# EasyEDA Pro project MicroMouse_v04.eprj, board PCB2
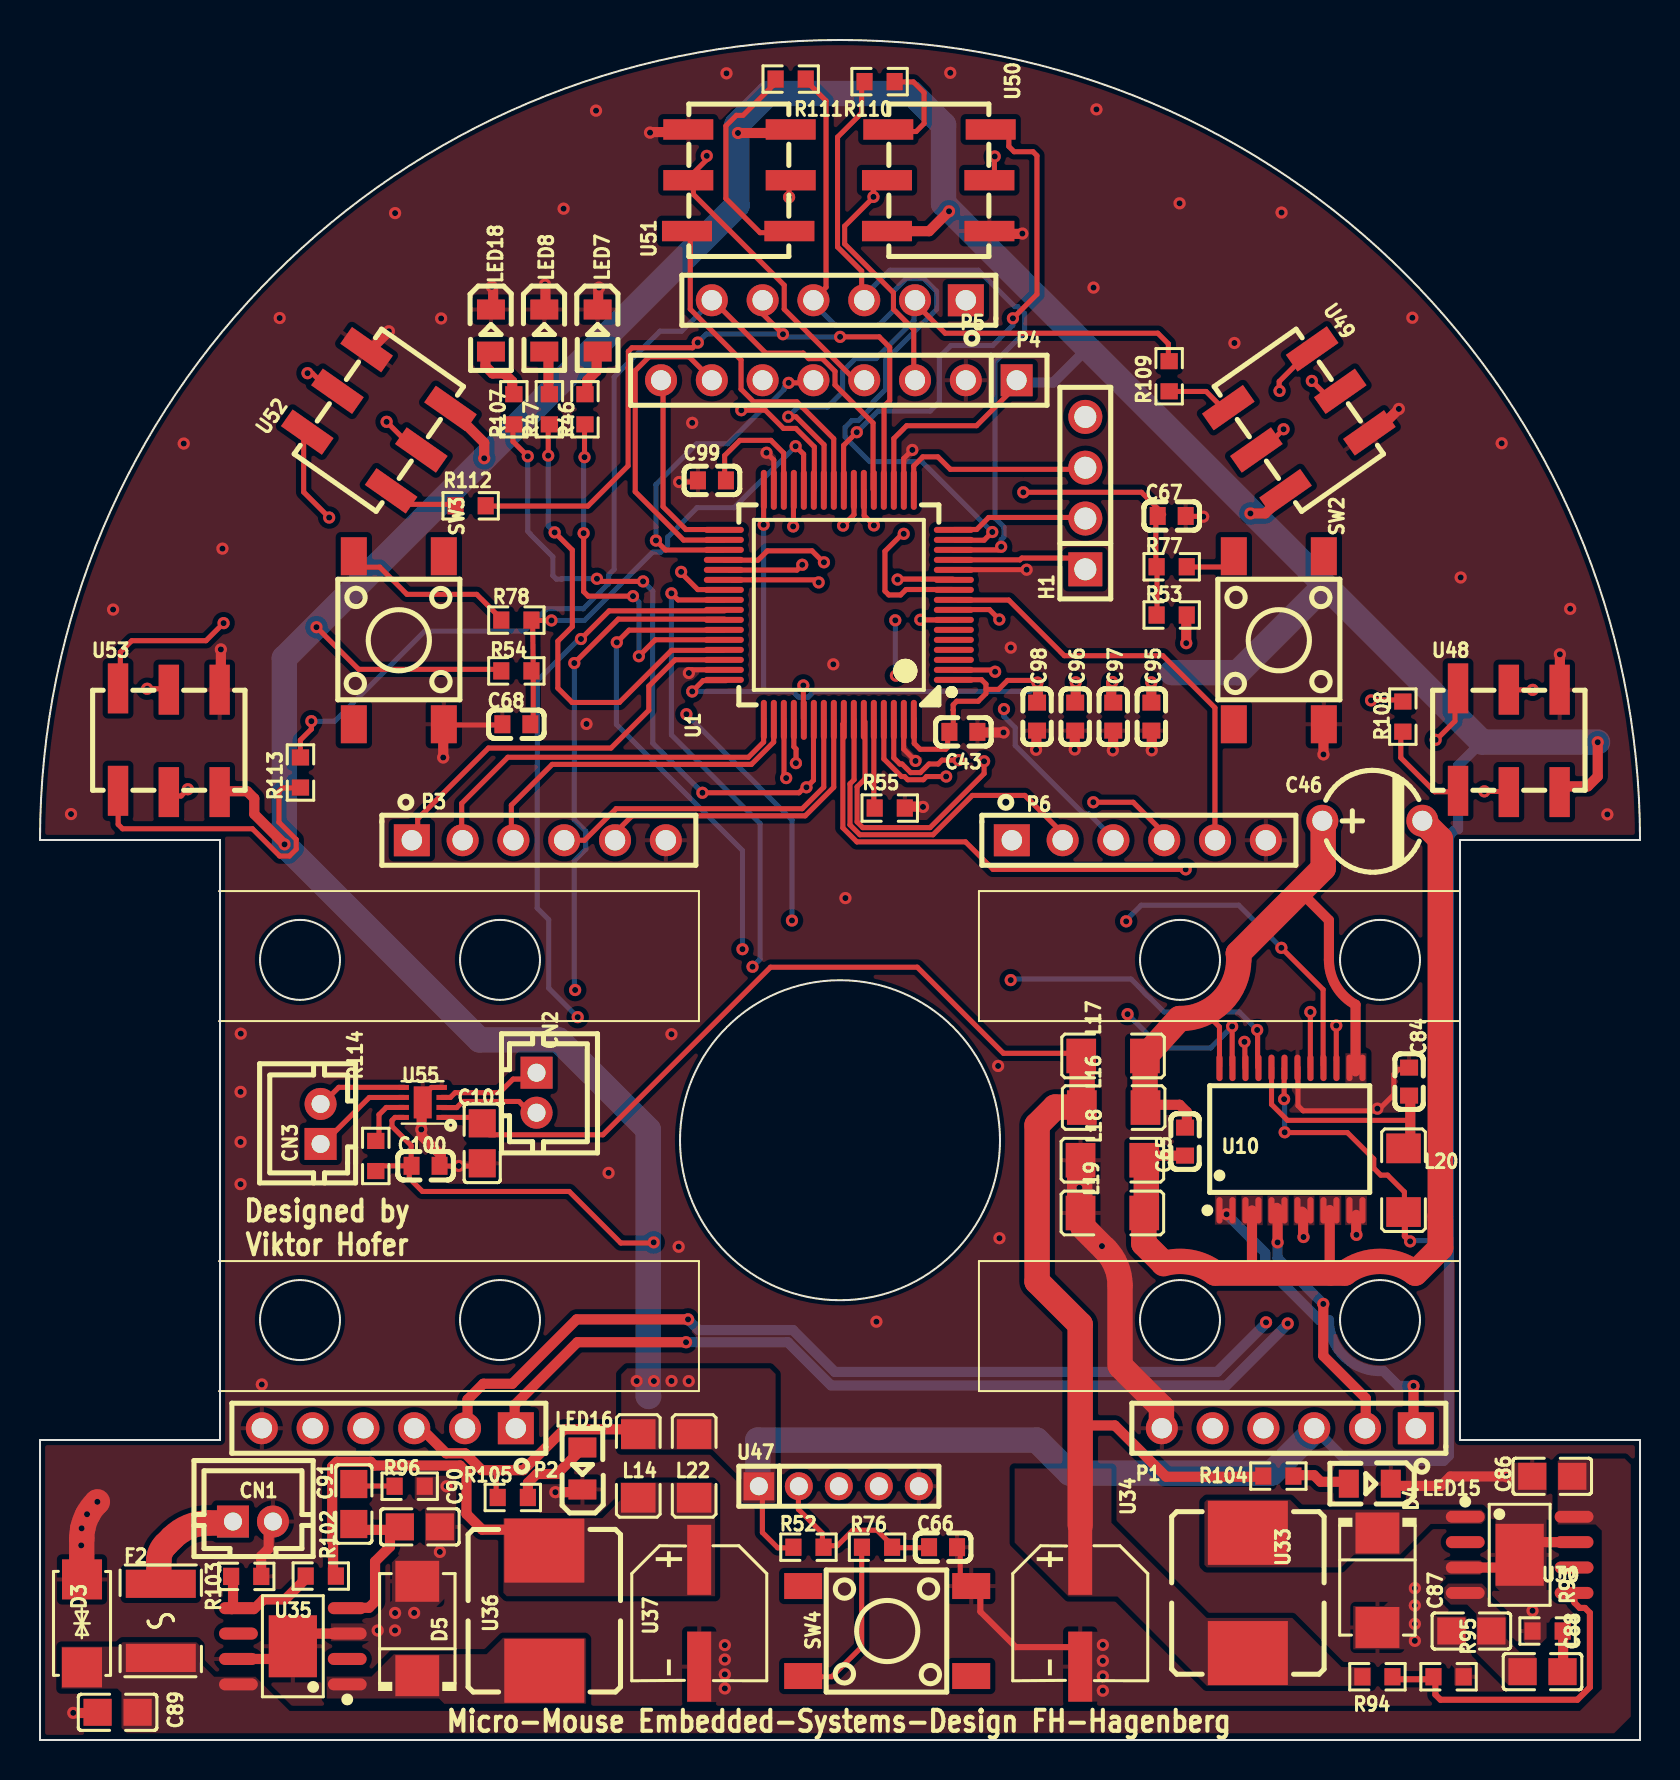
[diagram p6: board, top side]
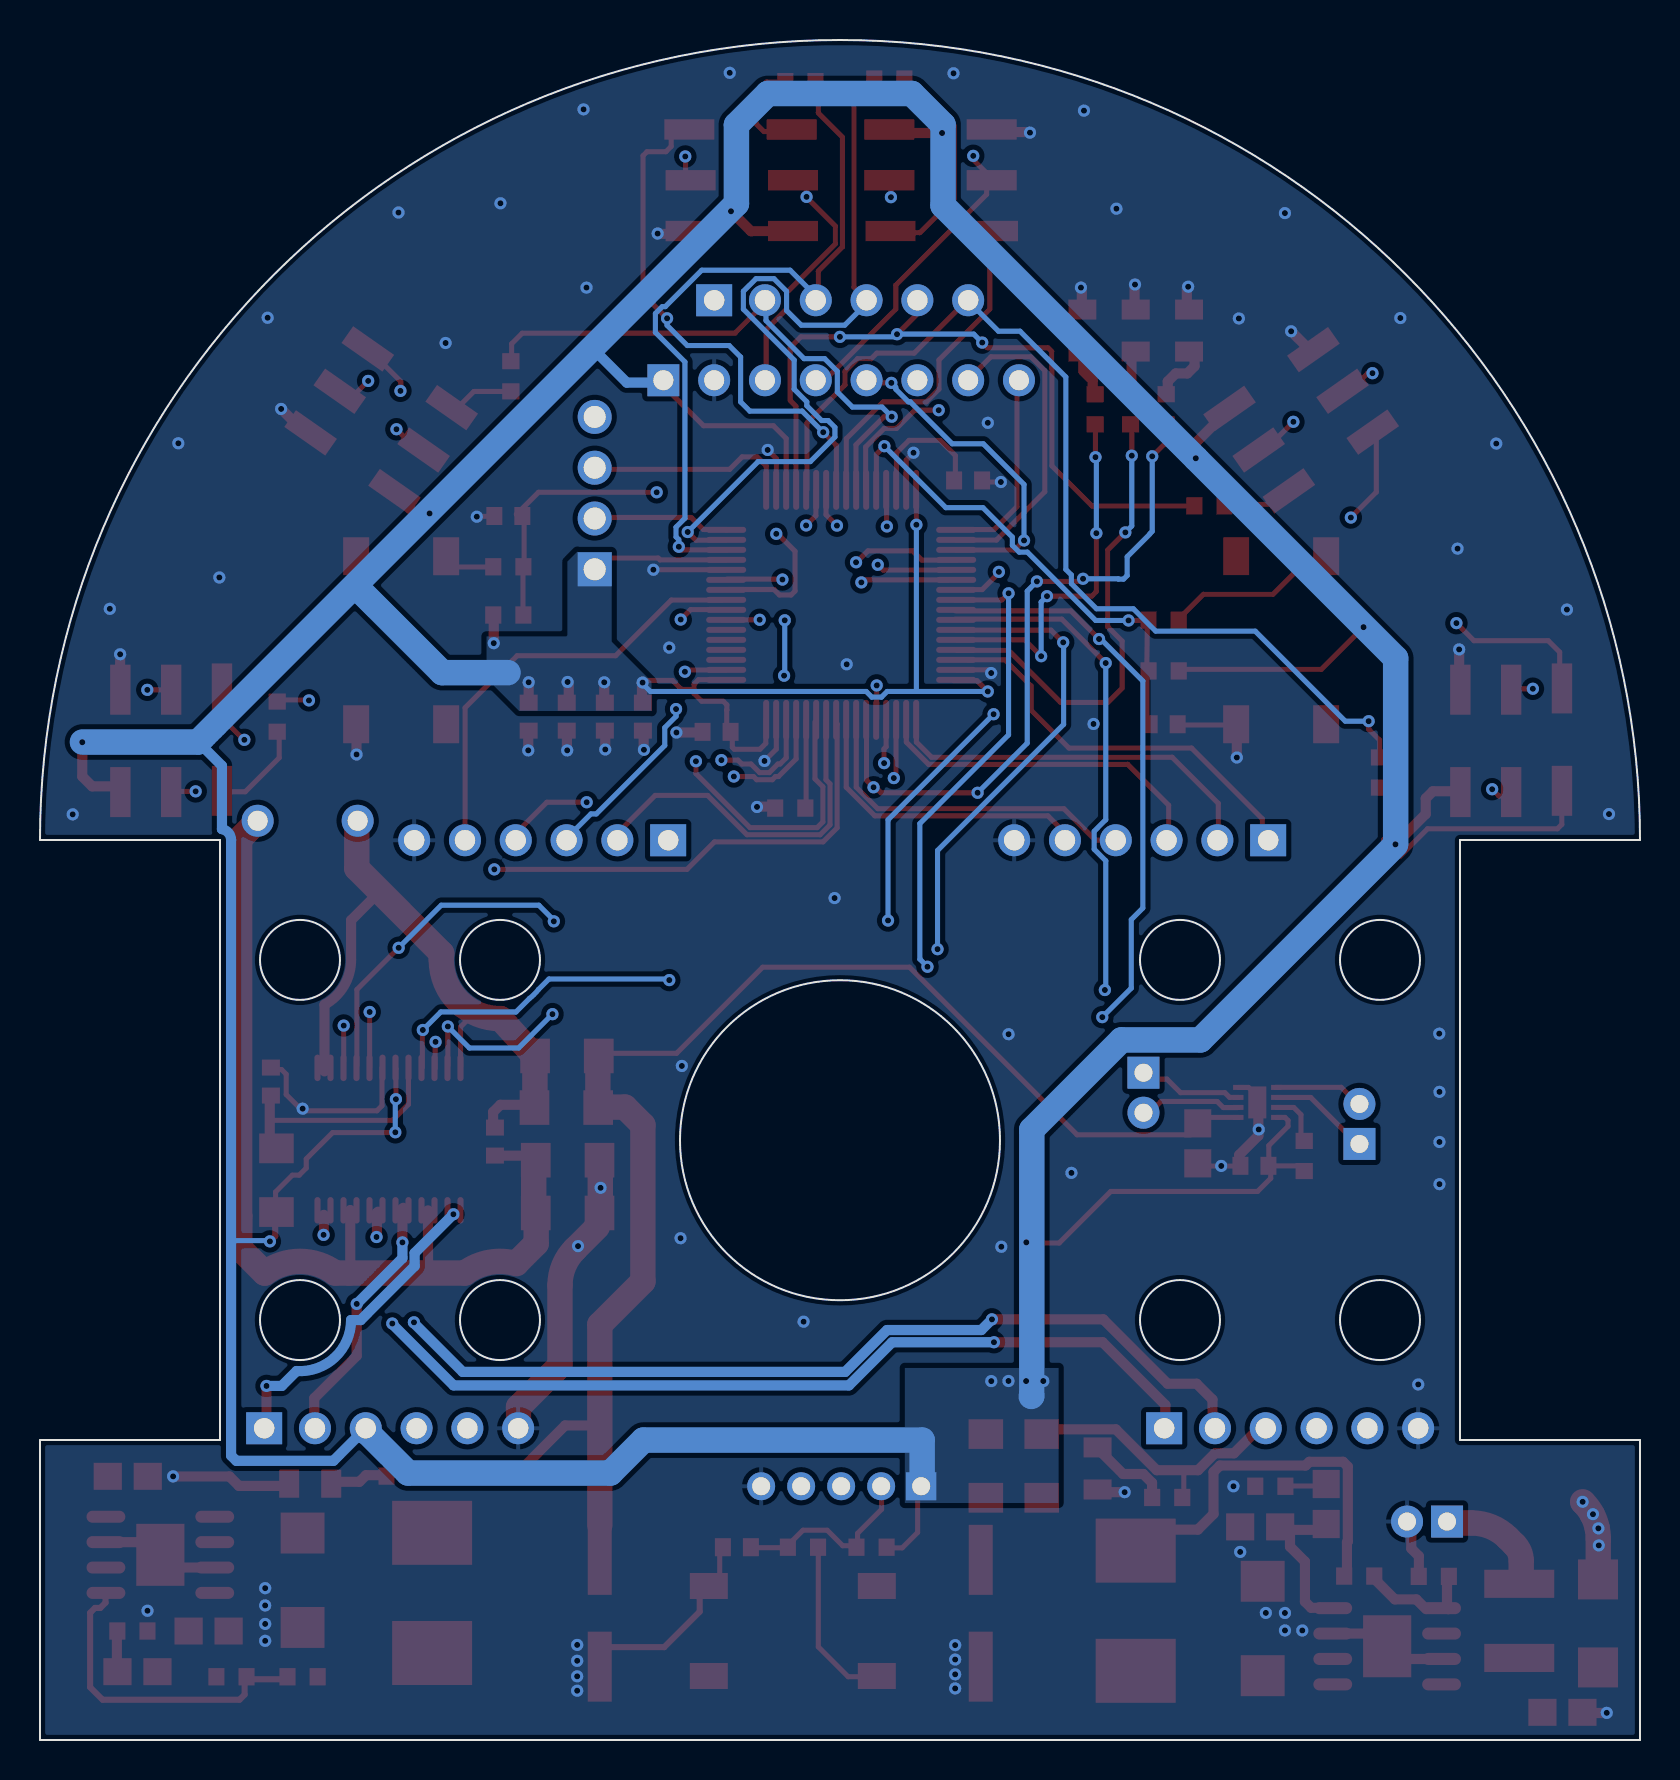
[diagram p7: board, bottom side, seen from below]

Outline 80 x 85 mm; copper layers: Top Layer, Inner1, Inner2, Inner3, Inner4, Bottom Layer. Coordinates in mm from the lower left corner of the outline.
Outline path: circle c13,39.01 r2 ; circle c13,21 r2 ; circle c23,39.01 r2 ; circle c23,21 r2 ; circle c40,29.99 r8 ; circle c57,39.01 r2 ; circle c57,21 r2 ; circle c67,39.01 r2 ; circle c67,21 r2 ; 0,45 9,45 9,15 0,15 0,0 80,0 80,15 71,15 71,45 80,45 arc(40,85) 0,45
Stack: Top Layer 0.035mm Outer layer thickness 1oz / Dielectric1 0.0994mm 3313 RC57% 4.2mil / Inner1 0.0152mm Inner layer thickness / Dielectric2 0.55mm 0.55mm H/H No copper / Inner2 0.0152mm Inner layer thickness / Dielectric3 0.1088mm 2116 RC54% 4.9mil / Inner3 0.0152mm Inner layer thickness / Dielectric4 0.55mm 0.55mm H/H No copper / Inner4 0.0152mm Inner layer thickness / Dielectric5 0.0994mm 3313 RC57% 4.2mil / Bottom Layer 0.035mm Outer layer thickness 1oz

## Design rules (mm)
template: JLCPCB Capability(Multiple Layers Board)
spacing copperThickness1oz (default): track to track 0.102, other pairs 0.152 to 0.3
spacing copperThickness2oz: track to track 0.203, other pairs 0.152 to 0.3
spacing copperThicknessInner0.5oz: track to track 0.089, other pairs 0.152 to 0.3
track width copperThickness1oz (default): min 0.102, default 0.254, max 2.54
track width copperThickness2oz: min 0.203, default 0.254, max 2.54
track width copperThickness0.5oz: min 0.089, default 0.254, max 2.54
differential pair differentialPair (default): width min 0.127, default 0.254, max 2.54; gap min 0.152, default 0.152
via viaSize (default): diameter min 0.3, default 0.61, max 10; hole min 0.2, default 0.305, max 6.3

## Placement (name value [footprint] x y rotation side)
C43  1uF  [C0603]  46.17 50.41 0 top
C46  10uF  [CAP-TH_BD5.0-P5.00-D1.0-FD]  66.62 45.96 0 top
C65  100nF  [C0603]  57.25 29.92 90 top
C66  100nF  [C0603]  45.15 9.64 180 top
C67  100nF  [C0603]  56.58 61.2 180 top
C68  100nF  [C0603]  23.82 50.79 0 top
C84  100nF  [C0603]  68.45 32.92 270 top
C86  10uF  [C0805]  75.61 13.18 0 top
C87  220pF  [C0805]  71.57 5.45 0 top
C88  22nF  [C0805]  75.13 3.42 180 top
C89  10uF  [C0805]  3.88 1.38 0 top
C90  220pF  [C0805]  18.99 10.66 180 top
C91  22nF  [C0805]  15.69 11.8 270 top
C95  100nF  [C0603]  55.57 51.17 90 top
C96  100nF  [C0603]  51.76 51.17 90 top
C97  100nF  [C0603]  53.66 51.17 90 top
C98  100nF  [C0603]  49.85 51.17 90 top
C99  4.7uF  [C0603]  33.6 62.98 0 top
C100  100nF  [C0603]  19.28 28.71 180 top
C101  10uF  [C0805]  22.11 29.83 90 top
CN1  HX-PH2.0-2PZZ  [CONN-TH_2P-P2.50_HX-PH2.0-2PZZ]  10.65 10.92 0 top
CN2  HX-PH2.0-2PZZ  [CONN-TH_2P-P2.50_HX-PH2.0-2PZZ]  24.83 32.36 270 top
CN3  HX-PH2.0-2PZZ  [CONN-TH_2P-P2.50_HX-PH2.0-2PZZ]  14.03 30.8 90 top
D3  SMAJ20CA  [SMA_L4.3-W2.6-LS5.2-BI]  2.1 5.83 270 top
D4  STPS2L25U  [SMB_L4.6-W3.6-LS5.3-RD]  66.87 7.99 270 top
D5  STPS2L25U  [SMB_L4.6-W3.6-LS5.3-RD]  18.86 5.58 90 top
F2  ASMD1812-300  [F1812]  6.04 5.96 90 top
H1  2.54-1*4P  [HDR-TH_4P-P2.54-V-F]  52.27 62.34 90 top
L14  LI1206H151R-10  [L1206]  29.91 13.7 90 top
L16  LI1206H151R-10  [L1206]  53.68 31.62 0 top
L17  LI1206H151R-10  [L1206]  53.65 34.2 0 top
L18  LI1206H151R-10  [L1206]  53.62 28.99 0 top
L19  LI1206H151R-10  [L1206]  53.62 26.35 0 top
L20  LI1206H151R-10  [L1206]  68.18 27.99 270 top
L22  LI1206H151R-10  [L1206]  32.71 13.7 90 top
LED7  XL-2012SURC  [LED0805-R-RD]  27.88 70.47 270 top
LED8  XL-2012SURC  [LED0805-R-RD]  25.21 70.47 270 top
LED15  XL-2012SURC  [LED0805-R-RD]  66.49 12.81 180 top
LED16  XL-2012SURC  [LED0805-R-RD]  27.12 13.58 90 top
LED18  XL-2012SURC  [LED0805-R-RD]  22.55 70.47 270 top
P1  2.54-1*6P  [HDR-TH_6P-P2.54-V-F]  62.44 15.59 180 top
P2  2.54-1*6P  [HDR-TH_6P-P2.54-V-F]  17.44 15.59 180 top
P3  2.54-1*6P  [HDR-TH_6P-P2.54-V-F]  24.94 44.99 0 top
P4  2.54-1*8P母环保  [HDR-TH_8P-P2.54-V-F_2]  39.94 67.99 180 top
P5  2.54-1*6P  [HDR-TH_6P-P2.54-V-F]  39.94 71.99 180 top
P6  2.54-1*6P  [HDR-TH_6P-P2.54-V-F]  54.94 44.99 0 top
R46  10K  [R0603]  27.25 66.54 270 top
R47  10K  [R0603]  25.47 66.54 270 top
R52  10K  [R0603]  38.42 9.64 180 top
R53  10K  [R0603]  56.58 56.25 0 top
R54  10K  [R0603]  23.82 53.45 180 top
R55  10K  [R0603]  42.49 46.6 0 top
R76  1kΩ  [R0603]  41.85 9.64 180 top
R77  1kΩ  [R0603]  56.58 58.66 0 top
R78  1kΩ  [R0603]  23.82 55.99 180 top
R93  4.7kΩ  [R0603]  75.38 5.45 0 top
R94  24kΩ  [R0603]  66.87 3.16 180 top
R95  6.2kΩ  [R0603]  70.43 3.16 180 top
R96  4.7kΩ  [R0603]  18.48 12.69 180 top
R102  3kΩ  [R0603]  14.04 8.2 0 top
R103  1.8kΩ  [R0603]  10.31 8.18 180 top
R104  10K  [R0603]  61.92 13.2 180 top
R105  10K  [R0603]  23.64 12.13 180 top
R107  10K  [R0603]  23.69 66.54 270 top
R108  0Ω  [R0603]  68.14 51.17 90 top
R109  0Ω  [R0603]  56.46 68.19 90 top
R110  0Ω  [R0603]  41.98 82.92 180 top
R111  0Ω  [R0603]  37.53 83.05 0 top
R112  0Ω  [R0603]  21.53 61.71 0 top
R113  0Ω  [R0603]  13.02 48.37 90 top
R114  10K  [R0603]  16.79 29.2 270 top
SW2  TS-1002S-04326C  [KEY-SMD_4P-L6.0-W6.0-P4.50-LS9.0]  61.94 54.99 270 top
SW3  TS-1002S-04326C  [KEY-SMD_4P-L6.0-W6.0-P4.50-LS9.0]  17.94 54.99 270 top
SW4  TS-1002S-04326C  [KEY-SMD_4P-L6.0-W6.0-P4.50-LS9.0]  42.36 5.45 0 top
U1  STM32F446RET6  [LQFP-64_L10.0-W10.0-P0.50-LS12.0-BL]  39.94 56.76 90 top
U10  TB6612FNG,C,8,EL  [SSOP-24_L8.3-W5.6-P0.65-LS7.6-BL]  62.55 30.05 0 top
U30  L5973D  [SOIC-8_L4.9-W3.9-P1.27-LS6.0-BL-EP]  73.98 9.26 270 top
U33  1.5uH  [IND-SMD_L7.6-W6.9]  60.39 7.35 270 top
U34  330uF  [CAP-SMD_BD6.3-L6.6-W6.6-LS7.4-FD]  52.01 6.34 270 top
U35  L5973D  [SOIC-8_L4.9-W3.9-P1.27-LS6.0-BL-EP]  12.64 4.69 90 top
U36  1.5uH  [IND-SMD_L7.6-W6.9]  25.21 6.46 90 top
U37  330uF  [CAP-SMD_BD6.3-L6.6-W6.6-LS7.4-FD]  32.96 6.34 270 top
U47  DW200R-11-05-43  [HDR-TH_5P-P2.00-V-F]  39.94 12.69 0 top
U48  HC-PM254-5.0H-2x3PS-02A  [CONN-SMD_HC-PM254-5.0H-2X3PS-02A]  73.44 49.99 0 top
U49  HC-PM254-5.0H-2x3PS-02A  [CONN-SMD_HC-PM254-5.0H-2X3PS-02A]  62.94 65.99 305 top
U50  HC-PM254-5.0H-2x3PS-02A  [CONN-SMD_HC-PM254-5.0H-2X3PS-02A]  44.94 77.99 270 top
U51  HC-PM254-5.0H-2x3PS-02A  [CONN-SMD_HC-PM254-5.0H-2X3PS-02A]  34.94 77.99 90 top
U52  HC-PM254-5.0H-2x3PS-02A  [CONN-SMD_HC-PM254-5.0H-2X3PS-02A]  16.94 65.99 55 top
U53  HC-PM254-5.0H-2x3PS-02A  [CONN-SMD_HC-PM254-5.0H-2X3PS-02A]  6.44 49.99 0 top
U55  DRV8838DSGR  [WSON-8_L2.0-W2.0-P0.50-TL-EP]  19.14 31.88 180 top

## Footprints (pads in the part's own frame, mm; a bottom-side part is the same pattern mirrored in y, then rotated)
C0603
  rect 0.8x0.9 smd: 1(-0.7,0) 2(0.7,0)
C0805
  rect 1.41x1.35 smd: 1(-1,0) 2(1,0)
CAP-SMD_BD6.3-L6.6-W6.6-LS7.4-FD
  rect 3.5x1.2 smd: 1(-2.67,0) 2(2.67,0)
CAP-TH_BD5.0-P5.00-D1.0-FD
  round 1.6 hole 1: 1(-2.5,0) 2(2.5,0)
CONN-SMD_HC-PM254-5.0H-2X3PS-02A
  rect 1.02x2.5 smd: 1(-2.54,2.592) 2(-2.54,-2.527) 3(0,2.527) 4(0,-2.592) 5(2.54,2.527) 6(2.54,-2.592)
CONN-TH_2P-P2.50_HX-PH2.0-2PZZ
  rect 1.6x1.6 hole 0.9: 1(-1,0)
  round 1.6 hole 0.9: 2(1,0)
F1812
  rect 1.407x3.499 smd: 1(-1.853,0) 2(1.853,0)
HDR-TH_4P-P2.54-V-F
  rect 1.7x1.7 hole 1.1: 1(-3.81,0)
  round 1.7 hole 1.1: 2(-1.27,0) 3(1.27,0) 4(3.81,0)
HDR-TH_5P-P2.00-V-F
  rect 1.524x1.4 hole 0.9: 1(-4,0)
  round 1.4 hole 0.9: 2(-2,0) 3(0,0) 4(2,0) 5(4,0)
HDR-TH_6P-P2.54-V-F
  rect 1.8x1.6 hole 1.02: 1(-6.35,0)
  round 1.6 hole 1.02: 2(-3.81,0) 3(-1.27,0) 4(1.27,0) 5(3.81,0) 6(6.35,0)
HDR-TH_8P-P2.54-V-F_2
  rect 1.6x1.6 hole 1: 1(-8.89,0)
  round 1.6 hole 1: 2(-6.35,0) 3(-3.81,0) 4(-1.27,0) 5(1.27,0) 6(3.81,0) 7(6.35,0) 8(8.89,0)
IND-SMD_L7.6-W6.9
  rect 3.2x4 smd: 1(-3.005,0) 2(3.005,0)
KEY-SMD_4P-L6.0-W6.0-P4.50-LS9.0
  rect 1.9x1.3 smd: 1(-4.2,2.25) 2(4.2,2.25) 3(-4.2,-2.25) 4(4.2,-2.25)
L1206
  rect 1.485x1.728 smd: 1(-1.593,0) 2(1.593,0)
LED0805-R-RD
  rect 1x1.399 smd: 1(1.05,0) 2(-1.05,0)
LQFP-64_L10.0-W10.0-P0.50-LS12.0-BL
  oval 0.3x2 smd: 1(-3.75,-5.75) 2(-3.25,-5.75) 3(-2.75,-5.75) 4(-2.25,-5.75) 5(-1.75,-5.75) 6(-1.25,-5.75) 7(-0.75,-5.75) 8(-0.25,-5.75) 9(0.25,-5.75) 10(0.75,-5.75) 11(1.25,-5.75) 12(1.75,-5.75) 13(2.25,-5.75) 14(2.75,-5.75) 15(3.25,-5.75) 16(3.75,-5.75) 33(3.75,5.75) 34(3.25,5.75) 35(2.75,5.75) 36(2.25,5.75) 37(1.75,5.75) 38(1.25,5.75) 39(0.75,5.75) 40(0.25,5.75) 41(-0.25,5.75) 42(-0.75,5.75) 43(-1.25,5.75) 44(-1.75,5.75) 45(-2.25,5.75) 46(-2.75,5.75) 47(-3.25,5.75) 48(-3.75,5.75)
  oval 2x0.3 smd: 17(5.75,-3.75) 18(5.75,-3.25) 19(5.75,-2.75) 20(5.75,-2.25) 21(5.75,-1.75) 22(5.75,-1.25) 23(5.75,-0.75) 24(5.75,-0.25) 25(5.75,0.25) 26(5.75,0.75) 27(5.75,1.25) 28(5.75,1.75) 29(5.75,2.25) 30(5.75,2.75) 31(5.75,3.25) 32(5.75,3.75) 49(-5.75,3.75) 50(-5.75,3.25) 51(-5.75,2.75) 52(-5.75,2.25) 53(-5.75,1.75) 54(-5.75,1.25) 55(-5.75,0.75) 56(-5.75,0.25) 57(-5.75,-0.25) 58(-5.75,-0.75) 59(-5.75,-1.25) 60(-5.75,-1.75) 61(-5.75,-2.25) 62(-5.75,-2.75) 63(-5.75,-3.25) 64(-5.75,-3.75)
R0603
  rect 0.806x0.864 smd: 1(-0.753,0) 2(0.753,0)
SMA_L4.3-W2.6-LS5.2-BI
  rect 2x2 smd: 1(-2.2,0) 2(2.2,0)
SMB_L4.6-W3.6-LS5.3-RD
  rect 2.047x2.192 smd: 1(-2.361,0) 2(2.361,0)
SOIC-8_L4.9-W3.9-P1.27-LS6.0-BL-EP
  oval 0.602x1.941 smd: 1(-1.905,-2.72) 2(-0.635,-2.72) 3(0.635,-2.72) 4(1.905,-2.72) 5(1.905,2.72) 6(0.635,2.72) 7(-0.635,2.72) 8(-1.905,2.72)
  rect 3.098x2.41 smd: 9(0,0)
SSOP-24_L8.3-W5.6-P0.65-LS7.6-BL
  oval 0.308x1.324 smd: 1(-3.575,-3.562) 2(-2.925,-3.562) 3(-2.275,-3.562) 4(-1.625,-3.562) 5(-0.975,-3.562) 6(-0.325,-3.562) 7(0.325,-3.562) 8(0.975,-3.562) 9(1.625,-3.562) 10(2.275,-3.562) 11(2.925,-3.562) 12(3.575,-3.562) 13(3.575,3.562) 14(2.925,3.562) 15(2.275,3.562) 16(1.625,3.562) 17(0.975,3.562) 18(0.325,3.562) 19(-0.325,3.562) 20(-0.975,3.562) 21(-1.625,3.562) 22(-2.275,3.562) 23(-2.925,3.562) 24(-3.575,3.562)
WSON-8_L2.0-W2.0-P0.50-TL-EP
  rect 0.521x0.25 smd: 1(-0.95,0.75) 2(-0.95,0.25) 3(-0.95,-0.25) 4(-0.95,-0.75) 5(0.95,-0.75) 6(0.95,-0.25) 7(0.95,0.25) 8(0.95,0.75)
  rect 0.9x1.6 smd: 9(0,0)

## Nets
As in the schematic.

Pads without a net: P4 6; SW2 1 4; SW3 1 4; SW4 1 4; U1 3 4 5 6; U30 2 6; U35 2 6

## Via types
v1: diameter 0.61, hole 0.305, Top Layer to Bottom Layer, 209 vias

## Routing (per net, layer and track width the routed paths; a pad name or vN(x,y) marks a point on that pad's centre or on a via; arc(x,y) is an arc through that point)
6V: length 72
  Top Layer w0.254: 21.88,31.08 21.84,31.13 U55.1 ; 22.48,30.26 28.14,30.26 36.53,38.64 43.86,38.64 48.17,34.34 51.75,34.34
  Top Layer w0.508: 52.33,15.71 52.34,15.73 53.74,15.73 56.31,13.16 60.98,13.16
  Top Layer w1.27: 52.01,10.75 52.01,20.77 49.85,22.93 49.85,30.75 50.75,31.65 52.11,31.65 52.11,34.1
+3V3: length 374.2
  Top Layer w0.254: 43.71,51.04 43.71,49.83 44,49.54 45.28,49.54 45.38,49.64 45.38,50.37 ; 22.81,11.87 22.81,13.34 22.71,13.44 ; v1(13.82,55.64) 15.93,53.53 23.08,53.53 ; 52.05,58.8 51.75,59.1 49.09,59.1 49,59.01 45.69,59.01 ; 45.59,53 45.6,53.02 47.08,53.02 47.3,52.79 47.3,52.33 46.91,51.94 45.84,51.94 45.66,51.76 45.66,51.51 45.66,51.5 45.66,50.7 ; v1(62.2,32.04) 62.2,33.56 62.22,33.58 ; 30.69,24.85 29.04,24.85 26.46,27.43 19.12,27.43 18.46,28.09 18.46,28.44 ; 18.18,31.13 17.75,31.13 17.6,30.98 17.6,30.68 18.56,29.72 18.56,28.9 18.57,28.89 ; v1(32.61,52.43) 33.15,52.97 34.31,52.97 ; 62.23,30.37 65.37,30.37 66.69,29.05 66.69,28.59 67.04,28.24 67.38,28.24 68.22,27.4 68.22,26.86 ; 49.74,52.98 48.38,52.98 47.93,52.53 47.31,52.53 47.3,52.54 ; 48.91,67.8 46.82,65.71 43.33,65.71 42.69,65.07 42.69,62.91 ; 36.18,62.5 v1(36.18,60.76) ; 37.5,9.61 36.89,9.61 36.12,10.38 36.12,12.57 ; 18.36,28.71 17.06,28.71 16.79,28.44
  Top Layer w0.305: v1(68.51,24.93) 68.24,25.2 68.24,26.29
  Top Layer w0.508: 8.97,47.52 9.05,47.44 10.35,47.44 10.71,47.08 10.71,46.3 v1(12.23,44.78) ; 20.54,66.53 22.21,64.86 v1(22.21,64.09) ; v1(53.62,52.9) 53.56,52.84 53.56,51.85 ; v1(77.89,49.89) 77.89,48.18 77.39,47.68 76.12,47.68 ; 42.55,75.44 44.45,75.44 v1(45.45,76.44) ; 55.55,51.91 55.57,51.92 v1(55.57,52.89) ; 57.31,56.17 v1(57.31,54.84) ; v1(51.79,52.89) 51.79,52.05 51.73,51.99 ; 19.28,15.36 20.3,14.33 21.25,14.33 22.1,13.49 24.16,13.49 26.21,15.53 29.47,15.53 29.59,15.4 ; v1(60.52,61.33) 61.26,61.33 62.31,62.38 ; v1(34.9,80.35) 37.29,80.35 37.51,80.57 ; 49.9,51.95 49.9,52.84
  Bottom Layer w0.254: 36.2,52.43 36.18,52.45 v1(36.18,60.76) ; v1(62.23,30.39) 62.23,32.01 v1(62.2,32.04) ; v1(32.61,52.43) 37.64,52.43 37.92,52.14 38.41,52.14 38.69,52.43 49.48,52.43 49.91,52.86 ; 68.53,24.97 70.33,24.97 70.36,25.01
  Bottom Layer w0.508: 72.05,49.86 70.9,48.71 70.9,45.55 arc(70.57,45.36) 70.45,45 70.45,14.22 70.18,13.96 65.33,13.96 63.53,15.76 ; 52.29,69.5 50.66,67.87 48.97,67.87
  Bottom Layer w1.27: 35.89,13.05 35.89,15 49.83,15 51.48,13.35 61.6,13.35 63.64,15.39 ; 77.88,49.9 72.09,49.9 45.18,76.82 45.18,80.76 43.61,82.33 36.41,82.33 34.85,80.77 34.85,76.72 22.21,64.09 12.22,54.09 12.22,44.82 ; 12.23,44.76 21.98,35.01 25.92,35.01 30.41,30.52 30.41,17.2 30.44,17.18 ; 56.6,53.37 59.89,53.37 64.18,57.65
  vias: v1(29.83,17.95) v1(30.68,24.88) v1(30.69,17.95) v1(31.58,17.95) v1(32.44,17.94) v1(49.87,52.87)
+6V_MOT: length 34.1
  Top Layer w0.254: 58.97,33.65 58.97,35.65 58.47,36.16
  Top Layer w0.508: 57.34,30.64 57.34,31.4 56.98,31.76 55.26,31.76 55.25,31.75 ; 65.78,33.43 65.78,36.76 arc(64.8,37.7) 64.45,39.01 64.45,40.99 63.08,42.35
  Top Layer w1.27: 55.25,34.17 55.25,34.24 ; 55.25,34.17 55.24,34.15 ; 55.25,34.17 55.25,31.62 ; 64.16,45.91 64.16,43.58 59.92,39.33 arc(59.93,39.17) 59.94,39.01 arc(59.07,36.92) 56.97,36.07 55.29,34.21
AGND: length 50.6
  Top Layer w0.508: 64.48,26.5 64.48,23.4 64.54,23.35 ; 60.6,26.48 60.6,23.49 60.65,23.44 ; 55.4,29.22 57.01,29.22 57.04,29.25
  Top Layer w1.27: 64.54,23.35 58.76,23.35 arc(57.52,23.88) 56.18,23.82 ; 70.02,26.2 70.03,24.61 68.76,23.34 ; 70.02,26.2 70.02,45.05 69.11,45.95 ; 70.02,26.2 70.02,24.91 ; 56.14,23.87 55.19,24.82 55.19,26.42 ; 64.54,23.35 65.25,23.35 arc(67,23.93) 68.76,23.35 ; 55.31,28.57 55.31,26.58
GND: length 101.7
  Top Layer w0.254: v1(31.96,62.9) 32.91,62.9 32.92,62.91 ; 34.15,53.51 32.6,53.51 v1(32.44,53.35) ; 46.25,7.82 46.01,8.06 46.01,9.71 ; 19.41,32.47 19.57,32.63 20.09,32.63 ; 36.69,62.51 36.69,64 v1(36.32,64.36) ; v1(43.78,48.95) 43.18,49.55 43.18,51.01 ; 20.6,50.75 22.97,50.75 23.1,50.62 ; 57.27,61.18 58.14,61.18 v1(58.16,61.17) ; 62.9,33.62 62.9,31.71 63.15,31.46 66.88,31.46 67.69,32.27 67.69,33.29 67.93,33.52 68.34,33.52 ; v1(43.62,64.5) 43.19,64.07 43.19,62.52 ; 45.72,58.51 v1(49.33,58.51) ; 22.15,28.7 19.95,28.7 19.94,28.69
  Top Layer w0.305: 52.17,4.64 48.79,4.64 47.02,6.42 47.02,7.28
  Top Layer w0.508: 72.92,8.63 72.91,8.62 71.26,8.62 ; 8.78,52.66 9.04,52.93 v1(9.04,54.53) ; 22.66,71.48 22.66,72.6 v1(22.59,72.66) ; 49.82,50.49 49.82,49.53 v1(49.8,49.51) ; 16.42,69.66 16.67,69.66 v1(17.44,70.44) ; 75.99,52.47 v1(75.99,54.29) ; 74.95,9.9 74.96,9.89 76.7,9.89 ; v1(44.15,46.65) 44.13,46.67 43.23,46.67 ; 19.08,31.75 19.08,30.21 20.04,29.25 20.04,28.87 ; 11.44,10.66 11.44,9.57 11.06,9.19 11.06,8.12 ; v1(27.95,72.62) 27.91,72.58 27.91,71.56 ; v1(25.25,72.77) 25.27,72.75 25.27,71.81 ; v1(30.5,80.37) 30.53,80.4 32.58,80.4 ; v1(49.12,75.32) 49.1,75.31 48.03,75.31 ; U35.3 13.28,5.32 U35.9 12.01,4.05 U35.7 ; 20.16,50.73 v1(20.16,49.12) ; 73.33,13.18 70.52,13.18 70.05,12.7 67.4,12.7 ; 53.66,50.51 53.66,49.5 v1(53.64,49.48) ; 55.59,50.3 v1(55.59,49.48) ; 66.35,65.29 66.68,65.29 v1(67.94,66.55) ; 27.34,12.39 v1(25.77,12.39) ; 46.9,50.45 46.98,50.38 v1(48.18,50.38) ; v1(51.74,49.53) 51.74,50.3 51.66,50.38 ; 64.09,51.03 64.17,50.95 v1(64.17,49.28) ; 2.47,1.35 1.67,1.35 v1(1.66,1.36)
  Top Layer w1.27: 52.14,25.65 53.26,24.53 arc(53.81,23.71) 54,22.74 54,18.73 ; v1(2.87,11.91) 2.83,11.87 arc(2.59,11.59) 2.39,11.27 arc(2.23,10.93) 2.14,10.57 arc(2.1,10.32) 2.09,10.08 2.09,8.31 ; 54.06,18.66 56.07,16.64 56.07,15.72 ; 51.99,29.03 51.99,26.3 51.94,26.26
  Bottom Layer w0.254: v1(32.44,53.35) 32.44,53.35
  vias: v1(1.55,46.3) v1(2.08,10.58) v1(2.06,9.73) v1(2.35,11.29) v1(3.65,56.52) v1(7.19,64.82) v1(9.12,59.57) v1(10.04,35.32) v1(10.03,32.41) v1(10.03,29.9) v1(10.03,27.79) v1(11.09,17.78) v1(11.98,71.1) v1(16.88,5.48) v1(17.75,76.34) v1(17.75,6.35) v1(17.75,5.48) v1(18.71,6.35) v1(19.06,30.53) v1(20.06,71.08) v1(19.99,9.4) v1(20.33,12.69) v1(20.94,28.7) v1(26.18,76.57) v1(27.32,50.8) v1(27.8,81.47) v1(28.43,28.36) v1(31.57,35.29) v1(31.93,24.66) v1(32.61,65.86) v1(34.24,4.74) v1(34.24,4.02) v1(34.24,3.28) v1(34.24,2.58) v1(34.32,83.33) v1(39.66,53.78) v1(40.27,42.1) v1(41.82,20.92) v1(45.51,83.36) v1(47.91,33.7) v1(47.97,25.09) v1(48.54,54.62) v1(51.97,27.61) v1(52.68,72.62) v1(52.82,81.53) v1(53.1,24.69) v1(53.14,4.75) v1(53.14,3.96) v1(53.14,3.18) v1(53.14,2.46) v1(56.98,76.83) v1(59.72,69.85) v1(62.08,76.37) v1(66.87,31.57) v1(68.62,71.11) v1(68.74,7.59) v1(68.74,6.73) v1(68.74,5.8) v1(68.74,4.96) v1(71.03,58.13) v1(73.08,64.84) v1(73.34,13.18) v1(74.63,6.46) v1(76.51,56.56) v1(78.37,46.28)
BOOT_O: length 4.3
  Top Layer w0.254: 41.64,46.68 41.69,46.73 41.69,51
BTN_02: length 34.5
  Top Layer w0.254: 38.72,62.52 38.72,64.65 37.79,65.58 37.17,65.58 36.26,66.49 v1(35.06,66.49) ; 55.79,58.7 55.79,61 55.85,61.06 ; 55.85,56.33 55.85,58.47 ; 56.18,61.28 55.08,62.39 v1(49.17,62.39)
  Inner2 w0.254: 49.07,62.38 44.61,66.84 36.11,66.84 35.73,66.46 35.11,66.46
BTN_03: length 24.4
  Top Layer w0.254: 24.53,55.98 24.63,55.88 24.66,53.4 24.66,50.81 ; v1(25.57,55.98) 24.72,55.98 ; 38.18,62.55 38.18,64.29 v1(37.78,64.69)
  Bottom Layer w0.254: v1(25.57,55.98) 27.21,55.98 30.63,59.39 31.04,59.39 31.38,59.73 31.38,60.14 32.85,61.62 34.71,61.62 v1(37.78,64.69)
ENC_OUT_A1: length 58.9
  Top Layer w0.254: 41.21,62.48 41.21,61.22 v1(41.69,60.73)
  Inner3 w0.254: 60.93,15.81 58.76,17.98 54.41,17.98 50.01,22.38 50.01,35.09 46.2,38.89 46.2,39.59 44.52,41.27 44.52,46.2 44.73,46.41 44.73,46.9 44.52,47.11 44.52,53.62 43.29,54.86 41.9,54.86 41.26,55.5 41.26,60.35 41.75,60.84
ENC_OUT_A2: length 56
  Top Layer w0.254: 34.23,56.46 28.46,56.46 v1(27.05,55.05)
  Inner3 w0.254: 16.14,15.83 16.14,30.16 20.86,34.88 25.67,34.88 26.89,36.1
  Bottom Layer w0.254: 27.03,55.13 24.86,52.95 24.86,41.6 25.44,41.02 25.44,37.59 v1(26.89,36.14)
ENC_OUT_B1: length 58.5
  Top Layer w0.254: v1(40.15,60.72) 40.7,61.27 40.7,62.49
  Inner3 w0.254: 40.07,60.79 40.07,55.06 41.26,53.87 43.58,53.87 43.76,53.69 43.76,49.77 43.19,49.2 43.19,46.79 43.76,46.22 43.76,40.44 49.32,34.89 49.32,21.89 53.77,17.44 56.98,17.44 58.71,15.71
ENC_OUT_B2: length 55.4
  Top Layer w0.254: 34.23,56.04 28.91,56.04 v1(26.71,53.85)
  Inner3 w0.254: 13.7,15.71 15.68,17.69 15.68,31.28 20.07,35.67 25.22,35.67 26.9,37.35
  Bottom Layer w0.254: 26.71,53.85 26.71,46.01 27.29,45.43 27.29,44.54 26.71,43.96 26.71,37.55 v1(26.76,37.5)
GPIO0_IR_LL: length 45.9
  Top Layer w0.254: 45.65,58.05 42.9,58.05 v1(42.88,58.02) ; 4.02,52.77 4.02,54.39 4.59,54.97 8.3,54.97 v1(9.18,55.84)
  Inner2 w0.254: 42.85,58.03 41.38,59.49 34.01,59.49 33.71,59.19 12.49,59.19 9.2,55.9
GPIO0_IR_LM: length 40.5
  Top Layer w0.254: 43.1,60.29 42.25,59.44 42.25,57.45 42.44,57.25 43.03,57.25 43.3,57.53 45.61,57.53 ; 13.18,65.27 13.18,62.4 v1(14.46,61.12)
  Inner2 w0.254: 14.65,61.01 35.6,61.01 35.94,61.35 41.9,61.35 42.24,61.01 42.48,61.01 v1(43.19,60.31)
GPIO0_IR_LR: length 17.2
  Top Layer w0.254: 32.3,75.35 32.51,75.14 32.51,71.54 35.05,69 35.05,67.54 35.68,66.91 37.84,66.91 39.69,65.07 39.69,62.48
GPIO0_IR_RL: length 25.5
  Top Layer w0.254: 48.48,80.18 48.44,80.14 48.44,79.68 48.7,79.41 49.65,79.41 49.85,79.22 49.85,72.29 v1(48.65,71.08) ; v1(40.84,65.39) 40.18,64.73 40.18,62.6
  Bottom Layer w0.254: v1(40.84,65.39) 41.89,66.44 44.51,66.44 44.97,66.91 44.97,69.15 45.54,69.72 47.64,69.72 48.65,70.73 v1(48.65,71.08)
GPIO0_IR_RM: length 25.6
  Top Layer w0.254: v1(47.76,53.41) 47.67,53.5 45.69,53.5 ; 63.54,69.51 61.96,67.92 61.96,67.46
  Inner2 w0.254: v1(61.98,67.46) 53.39,58.87 53.39,57.57 49.33,53.5 47.71,53.5
GPIO0_IR_RR: length 38.6
  Top Layer w0.254: v1(47.2,48.94) 47.2,48.32 44.5,45.62 41.14,45.62 40.85,45.9 40.85,47.66 41.25,48.06 41.25,50.91 ; 69.93,50.13 70.75,50.95 70.75,51.8
  Inner2 w0.254: v1(69.78,50.01) 68.62,48.85 64.57,48.85 64.42,48.69 63.93,48.69 63.78,48.85 47.2,48.85
GPIO1_IR_LL: length 15.3
  Top Layer w0.254: 3.95,46.81 3.91,46.77 3.91,45.78 4.13,45.56 10.62,45.56 11.98,44.2 12.47,44.2 12.81,44.54 12.81,45.02 11.95,45.89 11.95,47.42 12.12,47.6 12.87,47.6 13.07,47.41
GPIO1_IR_LM: length 3.1
  Top Layer w0.254: 20.86,61.78 18.29,61.78 17.94,62.14
GPIO1_IR_LR: length 10.7
  Top Layer w0.254: 36.77,82.86 35.15,81.23 34.82,81.23 34.29,80.71 34.29,77.07 36,75.37 37.27,75.37
GPIO1_IR_RL: length 4.6
  Top Layer w0.254: 42.96,80.42 43.8,80.42 44.2,80.82 44.2,82.37 43.67,82.9 42.89,82.9 42.83,82.96
GPIO1_IR_RM: length 2.8
  Top Layer w0.254: 56.55,67.43 58.31,67.43 59.06,66.67
GPIO1_IR_RR: length 4.4
  Top Layer w0.254: 70.78,47.41 69.74,47.41 68.04,49.11 68.04,50.05
I2C2_SCL: length 159.8
  Top Layer w0.254: 41.67,77.13 40.23,75.7 40.23,74.8 42.67,72.36 42.67,71.54 43.69,70.52 43.69,68.34 ; 37.67,62.48 37.67,60.69 v1(37.66,60.68) ; 41.67,77.92 v1(41.67,77.16) ; v1(62.18,65.54) 61.21,64.57 60.8,64.57 ; v1(7.39,47.54) 7.06,47.2 6.34,47.2 ; 19.1,64.46 18.78,64.46 v1(17.33,65.91) ; 73.42,47.43 72.22,47.43 v1(72.22,47.43) ; 37.45,77.96 v1(37.45,77.14)
  Inner3 w0.508: 29.38,46.67 36.9,54.19 36.9,59.97 37.5,60.56 ; 29.38,46.67 7.73,46.67 7.37,47.03 7.37,55.98 28.54,77.15 50.6,77.15 72.22,55.52 72.22,47.42
I2C2_SDA: length 159.3
  Top Layer w0.254: 47.72,78.03 47.72,79.16 v1(47.74,79.18) ; v1(63.59,67.95) 64.52,67.03 64.52,66.93 ; v1(13.38,68.34) 13.61,68.34 14.65,67.3 ; 32.43,78.11 33.34,79.02 v1(33.34,79.21) ; v1(5.36,52.56) 6.5,52.56 6.56,52.5 ; 40.91,67.84 37.21,71.54 37.21,72.74 32.67,77.28 32.67,77.83 ; 73.45,52.51 74.62,52.51 74.64,52.49 ; 38.17,51.07 v1(38.17,52.73)
  Inner2 w0.508: 63.6,67.94 74.63,56.91 74.63,52.5 ; 63.6,67.94 63.59,67.95 ; 63.6,67.94 63.63,67.94 ; 63.57,67.94 52.33,79.17 24.16,79.17 5.36,60.37 5.36,50.35 7.39,48.32 33.71,48.32 38.07,52.68
  vias: v1(74.63,52.51)
IMU_ADR: length 16.4
  Top Layer w0.254: 38.66,67.94 38.58,67.86 v1(37.43,67.86) ; 34.17,59.5 31.27,59.5 v1(30.8,59.98)
  Bottom Layer w0.254: v1(37.43,67.86) 37.21,67.63 37.21,67.54 36.58,66.91 36.48,66.91 34.39,64.81 32.83,64.81 30.8,62.77 v1(30.8,59.98)
IMU_BOOT: length 16.1
  Top Layer w0.254: 33.57,68.04 32.45,69.16 30.45,69.16 29.76,68.47 29.76,62.41 32.18,60 34.2,60
IMU_RESET: length 9.6
  Top Layer w0.254: 34.21,60.52 32.29,60.52 31.15,61.67 31.15,67.73
M_AIN1: length 52.7
  Top Layer w0.254: v1(28.84,54.88) 29.45,55.49 34.2,55.49 ; v1(60.86,35.5) 60.88,35.48 60.88,33.63
  Inner2 w0.254: v1(48.54,38) 46.98,39.56 35.13,39.56
  Bottom Layer w0.254: 28.82,54.77 28.82,50.78 35.12,44.48 v1(35.12,39.54) ; 48.58,38.05 54.55,38.05 55.07,37.53 arc(55.28,37.29) 55.52,37.08 56.2,36.4 59.96,36.4 v1(60.86,35.5)
M_AIN2: length 51.2
  Top Layer w0.254: 34.23,57 31.9,57 v1(31.57,57.33) ; v1(60.22,34.91) 60.24,34.89 60.24,33.59
  Inner2 w0.254: 60.24,34.95 50.75,34.95 46.6,39.1 36.01,39.1 35.7,38.8
  Bottom Layer w0.254: v1(31.57,57.33) 31.57,50.26 36.01,45.82 36.01,39.04 v1(35.63,38.66)
M_AO1: length 15.9
  Top Layer w0.508: v1(68.67,17.7) 68.67,15.55 68.73,15.49
  Bottom Layer w0.508: v1(59.33,26.29) 61.27,24.35 61.27,23.69 63.97,21 64.45,21 arc(65.25,19.13) 67.17,18.45 67.91,17.7 v1(68.67,17.7)
M_AO2: length 12.7
  Top Layer w0.508: 66.29,15.8 66.29,17.09 64.16,19.21 v1(64.16,21.8) ; 61.83,26.61 61.88,26.56 v1(61.88,24.88)
  Bottom Layer w0.508: v1(61.88,24.88) 61.88,24.09 v1(64.16,21.8)
M_BIN1: length 35.6
  Top Layer w0.254: 40.17,51.01 40.17,50.83 40.14,50.8 40.14,45.61 40.85,44.91 46.28,44.91 47.65,43.53 v1(57.28,43.53) ; 63.5,36.27 63.52,36.25 63.52,33.63
  Inner2 w0.254: 57.32,43.37 63.52,37.17 v1(63.52,36.4)
M_BIN2: length 55.4
  Top Layer w0.254: 33.82,57.52 32.89,57.52 32.09,58.32 ; 64.15,33.74 64.15,37.52 v1(62.07,39.61)
  Inner2 w0.254: 37.46,40.98 48.4,40.98 49.26,41.83 53.41,41.83 v1(54.31,40.93)
  Inner3 w0.254: v1(32.32,51.29) 32.32,51.89 31.86,52.35 31.86,53.59 32.32,54.05 32.32,58.06 32.01,58.36
  Bottom Layer w0.254: v1(37.6,40.97) 37.6,46.01 v1(32.32,51.29) ; 54.33,41.02 55.06,41.74 59.94,41.74 v1(62.07,39.61)
  vias: v1(32.06,58.41)
M_BO1: length 50.1
  Top Layer w0.508: 23.73,15.69 23.73,16.75 26.87,19.89 v1(32.3,19.89) ; 65.81,26.26 65.81,25.27 65.8,25.26
  Inner2 w0.508: 62.39,20.82 63.03,21.45 63.03,22.39 65.81,25.17 65.81,25.28
  Bottom Layer w0.508: 62.39,20.8 59.32,17.73 39.55,17.73 37.39,19.89 v1(32.3,19.89)
  vias: v1(62.39,20.82) v1(65.82,25.26)
M_BO2: length 51.3
  Top Layer w0.508: 21.38,15.67 21.38,17.02 22.17,17.81 23.62,17.81 26.83,21.03 v1(32.4,21.03) ; 63.1,26.42 63.16,26.36 63.16,25.15
  Inner2 w0.508: v1(61.3,20.88) 61.3,23.23 63.1,25.03
  Bottom Layer w0.508: v1(32.4,21.03) 32.93,20.5 37.65,20.5 39.74,18.41 58.87,18.41 61.35,20.89
  vias: v1(63.17,25.15)
M_PWMA: length 34.4
  Top Layer w0.254: v1(45.31,48.17) 44.33,48.17 44.17,48.01 43.39,48.01 43.23,48.17 43.07,48.17 42.19,49.05 42.19,50.99 ; v1(59.61,35.68) 59.61,33.74
  Inner2 w0.254: v1(54.38,36.29) 54.38,40.18 54.89,40.69 54.89,45.29 54.38,45.81 54.38,46.75 53.19,47.94 46.41,47.94 46.1,48.24 45.3,48.24
  Bottom Layer w0.254: v1(54.38,36.29) 56.07,34.6 58.53,34.6 v1(59.61,35.68)
M_PWMB: length 35.1
  Top Layer w0.254: 42.69,51 42.69,49.11 42.99,48.8 43.1,48.8 43.53,48.37 44.02,48.37 44.45,48.8 44.91,48.8 45.1,48.99 v1(45.93,48.99) ; 64.81,33.96 64.81,35.7 64.79,35.72
  Inner2 w0.254: 45.9,48.94 46.56,48.29 57.87,48.29 60.07,46.09 60.07,43.26 64.59,38.74 arc(64.67,38.33) 64.81,37.95 v1(64.81,35.72)
PA0: length 36.5
  Top Layer w0.254: 40.82,71.89 41.08,72.16 41.08,73.45 39.88,74.65 39.88,80.14 41.08,81.35 41.08,83.05 ; 45.64,59.51 47.9,59.51 v1(48.06,59.66)
  Bottom Layer w0.254: 41.36,72.36 42.49,73.49 46.92,73.49 48.73,71.67 48.89,71.67 49.23,71.33 49.23,70.38 47.75,68.9 47.75,61.09 48.2,60.64 48.2,60.16 48.06,60.02 v1(48.06,59.66)
PA1: length 40.4
  Top Layer w0.254: v1(47.61,60.4) 47.2,59.99 45.75,59.99 ; 38.84,72.18 39.3,72.64 39.3,81.96 38.38,82.88
  Bottom Layer w0.254: 38.76,71.92 38.76,71.74 39.76,70.74 41.94,70.74 42.67,71.48 42.67,72.43 43.3,73.07 44.2,73.07 44.83,72.43 44.83,71.54 42.29,69 42.29,67.54 41.66,66.91 41.66,66.71 40.92,65.97 40.6,65.97 40.26,65.63 40.26,65.15 41.48,63.92 44.09,63.92 v1(47.61,60.4)
PA4: length 36.3
  Top Layer w0.254: v1(37.15,70.29) 36.07,71.37 36.07,71.98 ; v1(32.89,69.87) 32.63,69.61 29.6,69.61 29.42,69.43 29.42,68.63 29.4,68.61 29.4,63.71 27.4,61.7 22.54,61.7 ; v1(40,70.16) 41.96,70.16 42.49,69.63 42.49,66.97 42.2,66.69 42.2,62.53
  Bottom Layer w0.254: 37.16,70.28 v1(37.15,70.29) ; 37.18,70.3 33.31,70.3 v1(32.89,69.87) ; v1(40,70.16) 37.28,70.16
PA5: length 50.7
  Top Layer w0.254: 33.76,71.87 36.29,69.34 38.16,69.34 38.44,69.07 39.12,69.07 39.75,68.43 39.75,67.75 41.65,65.85 41.65,62.51 ; v1(13.57,50.94) 13.57,50.55 13.02,50 13.02,49.05
  Bottom Layer w0.254: 33.48,71.84 32.08,70.44 31,70.44 28.71,68.15 28.71,58.53 28.43,58.25 28.43,57.82 27.17,56.56 25.33,56.56 24.21,55.44 19.24,55.44 14.73,50.94 v1(13.57,50.94)
PB0: length 28.4
  Top Layer w0.254: 43.89,71.7 45.26,70.34 55.89,70.34 56.42,69.81 56.42,69.06 ; 39.2,62.52 39.2,64.76 37.8,66.16 v1(37.41,66.16)
  Bottom Layer w0.254: v1(37.41,66.16) 37.9,66.65 39.38,66.65 40.13,67.4 40.13,68.43 40.76,69.07 41.8,69.07 43.7,70.97 43.7,71.82
PC0: length 43.5
  Top Layer w0.254: 68.02,52 66.6,52 66.53,51.94 ; 45.86,56.52 47.47,56.52 v1(47.97,56.02)
  Inner2 w0.254: 46.36,71.76 46.36,70.97 46.91,70.42 49.15,70.42 50.23,69.34 50.23,58.33 47.99,56.09
  Inner3 w0.254: v1(66.55,51.98) 62.66,55.87 48.03,55.87
SPI3_CS0: length 27.6
  Top Layer w0.254: 34.2,58.99 35.9,58.99 36.37,59.46 38.6,59.46 39.16,58.89
  Inner2 w0.254: 48.24,51.68 44.7,55.22 40.91,55.22 40.73,55.4 40.73,57.35 v1(39.2,58.89)
  Bottom Layer w0.254: 53.78,44.98 52.45,46.3 52.18,46.3 48.76,49.73 48.76,50.62 48.2,51.18 v1(48.2,51.55)
SPI3_CS1: length 18
  Top Layer w0.254: 50.97,45.03 50.97,45.5 49.24,47.23 46.62,47.23 44.65,45.26 40.99,45.26 40.5,45.76 40.5,47.81 40.7,48.01 40.7,50.99
SPI3_MISO: length 22.4
  Top Layer w0.254: 56.33,45.22 54.66,46.89 v1(52.67,46.89) ; 37.69,51 37.69,49.66 37.8,49.55 37.8,48.89 37.73,48.82
  Inner2 w0.254: 37.77,48.85 37.87,48.95 42.68,48.95 44.4,47.23 51.62,47.23 52.01,46.84 52.57,46.84 52.59,46.82
  vias: v1(37.8,48.84)
SPI3_MOSI: length 21.7
  Top Layer w0.254: 58.68,44.99 58.68,45.09 58.75,45.15 58.75,51.61 56.14,54.21 51.22,54.21 48.43,57 45.91,57
SPI3_SCK: length 15.5
  Top Layer w0.254: 37.2,51 37.2,48.21 v1(37.31,48.1)
  Inner2 w0.254: 48.55,44.99 46.73,44.99 45.65,46.07 43.91,46.07 41.57,48.41 38.27,48.41 38,48.14 37.51,48.14
ST_LED1: length 18.6
  Top Layer w0.254: v1(29.94,54.19) 30.76,55.01 34.15,55.01 ; v1(27.18,60.34) 27.18,57.42 27.41,57.19 v1(29.65,57.19) ; v1(27.23,64.14) 27.23,65.72 27.2,65.75
  Bottom Layer w0.254: v1(29.94,54.19) 29.94,56.9 v1(29.65,57.19) ; v1(27.18,60.34) 27.18,64.1 v1(27.23,64.14)
ST_LED2: length 23.7
  Top Layer w0.254: 25.47,65.77 25.41,65.71 v1(25.41,64.22) ; 34.17,54.48 31.57,54.48 28.97,51.88 26.61,51.88 25.89,52.59 25.89,54.94 26.62,55.67 26.62,59.5 v1(25.73,60.38)
  Bottom Layer w0.254: v1(25.41,64.22) 25.41,60.7 v1(25.73,60.38)
ST_LED3: length 33.4
  Top Layer w0.254: 38.27,47.68 37.95,47.36 v1(33.12,47.36) ; 38.67,50.82 38.67,47.99 v1(38.32,47.64) ; v1(24.39,64.18) 23.65,64.93 23.65,65.78 ; v1(30.15,57.93) 27.98,57.93 v1(27.85,58.06)
  Bottom Layer w0.254: v1(33.12,47.36) 30.64,49.84 30.64,57.45 v1(30.15,57.93) ; v1(27.85,58.06) 26.09,58.06 26.07,58.04 25.82,58.04 25.64,58.22 25.64,59.16 24.51,60.3 ; 24.52,60.31 24.39,60.44 v1(24.39,64.18)
STLINK_JTDI: length 17.1
  Top Layer w0.254: 36.68,50.94 36.68,49.9 35.57,48.78 25.61,48.78 23.57,46.74 23.57,45.1
STLINK_NJTRST: length 15.4
  Top Layer w0.254: 28.66,45.26 29.6,46.21 38.26,46.21 39.69,47.64 39.69,51
STLINK_NRST: length 83.2
  Top Layer w0.254: 39.17,9.67 39.2,9.71 39.86,9.71 40.64,10.49 41.85,10.49 42.59,9.75 ; 44.28,9.62 42.64,9.62 ; 45.88,56.01 44.02,56.01 v1(44.02,56.01) ; 39.12,9.6 39.12,10.33 37.92,11.53 37.92,12.65
  Inner3 w0.254: 38.25,12.64 38.25,12.24 39.19,11.29 44.82,11.29 48.63,15.11 48.63,34.76 42.8,40.59 42.8,53.2 ; v1(42.76,55.99) 43.85,55.99 43.88,55.95 ; 44.12,56.05 44.12,60.56 49.55,65.98 52.25,65.98
  Bottom Layer w0.254: v1(42.76,55.99) 42.76,53.25 v1(42.8,53.22)
STLINK_RX: length 9.5
  Top Layer w0.254: 43.69,62.97 43.69,63.7 44.14,64.16 44.89,64.16 45.52,63.53 51.98,63.53
STLINK_SWO: length 17.4
  Top Layer w0.254: 26.24,44.99 27.23,44.99 28.8,46.56 38.11,46.56 39.19,47.64 39.19,51
STLINK_TCK: length 19.3
  Top Layer w0.254: 21.08,45.01 21.08,46.83 23.39,49.14 35.42,49.14 36.18,49.9 36.18,51.04
STLINK_TMS: length 19.6
  Top Layer w0.254: 33.58,54.01 31.76,54.01 30.44,52.7 30.44,51.49 28.55,49.6 22.42,49.6 18.88,46.06 18.88,45.14
STLINK_TX: length 6.8
  Top Layer w0.254: 45.67,60.51 45.69,60.53 46.83,60.53 47.43,61.13 52.22,61.13 52.24,61.11
UART_RX: length 58.8
  Top Layer w0.254: 34.58,58.01 38.8,58.01 v1(38.93,57.88)
  Inner3 w0.254: 41.77,12.96 41.77,14.04 32.96,22.86 31.23,22.86 30.05,24.03 30.05,38.07 36.45,44.47 36.45,52.02 38.89,54.46 38.89,57.87
UART_TX: length 58.6
  Top Layer w0.254: 34.45,58.5 37.85,58.5 v1(38.11,58.76)
  Inner3 w0.254: 39.78,12.86 39.78,15.53 32.81,22.5 30.81,22.5 29.69,23.61 29.69,38.22 36.1,44.62 36.1,52.28 38.12,54.31 38.12,58.81
$2N19187: length 5.7
  Top Layer w1.27: 5.94,7.84 5.94,8.96 arc(6.03,9.39) 6.27,9.76 6.62,10.11 arc(7.44,10.66) 8.41,10.85 9.59,10.85
$2N30811: length 1.9
  Top Layer w0.508: 76.26,3.62 76.16,3.72 76.16,5.43
$2N33033: length 16.1
  Top Layer w0.305: 67.61,3.15 67.72,3.04 69.48,3.04 ; 69.77,3.1 69.77,2.27 70.02,2.01 76.87,2.01 77.49,2.64 77.49,6.36 77.25,6.6 76.99,6.6 76.72,6.87 76.72,7.38
$2N33519: length 2
  Top Layer w0.254: 15.85,12.7 17.85,12.7 17.87,12.72
$2N33542: length 6.3
  Top Layer w0.508: 15.97,6.61 16.44,6.61 16.75,6.92 16.75,8.92 17.5,9.67 17.5,10.42 17.41,10.51 ; 17.41,10.51 15.96,10.51
$2N33543: length 16.9
  Top Layer w0.508: 23.7,10.53 23.69,10.52 22.11,10.52 21.32,11.3 21.32,13.4 21,13.72 16.72,13.72 16.53,13.91 14.85,13.91 14.61,13.67 14.61,9.93 14.65,9.88 14.65,8.64
$2N33549: length 4.5
  Top Layer w0.508: 13.16,7.93 12.26,7.03 11.18,7.03 10.69,6.54 ; 9.59,6.54 9.65,6.6 9.65,7.95
$2N34682: length 4.2
  Top Layer w0.508: 27.2,14.66 25.85,13.3 24.84,13.3 24.4,12.86 24.4,12.23
$2N34710: length 2.4
  Top Layer w0.508: 65.31,12.91 64.03,12.91 63.7,13.24 63.02,13.24
$3N1929: length 2.9
  Top Layer w0.254: 59.85,59.35 59.14,58.65 57.25,58.65
$3N2172: length 8.1
  Top Layer w0.254: 15.89,58.64 16.99,58.64 18.35,57.28 21.83,57.28 22.96,56.15
$3N2375: length 8.2
  Top Layer w0.254: 41.08,9.38 41.08,4.66 39.59,3.16 38.27,3.16
$3N4904: length 2.2
  Top Layer w0.508: 27.19,67.37 27.36,67.54 27.36,67.99 27.83,68.45 27.83,69.33
$3N4908: length 2.1
  Top Layer w0.508: 25.42,67.35 25.42,69.44 25.42,69.45
$3N28848: length 6.5
  Top Layer w0.254: 37.18,62.5 37.18,64.35 36.55,64.98 34.99,64.98 34.23,64.22 34.23,63.13
$3N34738: length 3
  Top Layer w0.508: 22.25,69.43 22.27,69.4 22.27,68.69 22.63,68.33 23.21,68.33 23.61,67.93 23.61,67.3
$8N894: length 11.5
  Top Layer w0.254: 61.58,33.62 61.58,31.78 62.37,30.98 68.41,30.98
  Top Layer w0.508: 68.51,29.64 68.51,32.05 68.44,32.13
$9N511: length 4.5
  Top Layer w0.254: 20.08,32.13 20.52,32.13 20.76,32.37 22.98,32.37 23.65,33.05 24.19,33.05
$9N515: length 4.4
  Top Layer w0.254: 24.28,31.6 23.95,31.93 21.14,31.93 20.84,31.62 20.1,31.62
$9N597: length 2.5
  Top Layer w0.254: 16.95,30.12 16.95,31.27 17.31,31.63 18.19,31.63
$9N798: length 4.6
  Top Layer w0.254: 18.2,32.13 16.46,32.13 14.41,30.08
$9N807: length 4.3
  Top Layer w0.254: 18.22,32.63 14.94,32.63 14.2,31.89

## Copper pours and planes (outline as drawn; the poured copper is in the pictures)
6V on Top Layer: 48.73,13.58 66.56,13.58 66.56,2.71 48.73,2.71
+3V3 on Top Layer: 29.06,18.58 36.78,18.58 36.78,11.85 29.06,11.85
+3V3 on Bottom Layer: 29.07,18.6 36.76,18.6 36.76,11.85 29.07,11.85
+3V3 on Bottom Layer: 49.42,59.42 57.67,59.42 57.67,51.44 49.42,51.44
+6V_MOT on Top Layer: 65.27,34.34 66.32,34.34 66.32,32.86 65.27,32.86
AGND on Top Layer: 63.96,27.21 65.06,27.21 65.06,25.75 63.96,25.75
AGND on Top Layer: 60.07,27.22 61.14,27.22 61.14,25.74 60.07,25.74
GND on Top Layer: 65.66,8.99 72.1,8.99 72.1,2.7 65.66,2.7
GND on Top Layer: -0.14,85.28 80.25,85.28 80.25,0.14 -0.14,0.14
GND on Top Layer: 51.4,5.41 53.74,5.41 53.74,1.92 51.4,1.92
GND on Top Layer: 14.55,13.17 20.77,13.17 20.77,4.94 14.55,4.94
GND on Top Layer: 32.35,5.42 34.9,5.42 34.9,1.89 32.35,1.89
GND on Top Layer: 72.77,13.87 75.34,13.87 75.34,4.84 72.77,4.84
GND on Bottom Layer: -0.25,85.28 80.35,85.28 80.35,0.14 -0.25,0.14
GND on Inner1: 0.26,84.75 79.74,84.75 79.74,0.26 0.26,0.26
GND on Inner2: -0.04,85.28 80.45,85.28 80.45,0.24 -0.04,0.24
GND on Inner3: -0.25,85.18 80.45,85.18 80.45,0.14 -0.25,0.14
GND on Inner4: 0.26,84.75 79.74,84.75 79.74,0.26 0.26,0.26
LIPO+ on Top Layer: 1.07,14.07 79.54,14.07 79.54,0.34 1.07,0.34
M_AO1 on Top Layer: 58.74,27.22 59.81,27.22 59.81,25.77 58.74,25.77
M_AO2 on Top Layer: 61.37,27.22 62.43,27.22 62.43,25.73 61.37,25.73
M_BO1 on Top Layer: 65.26,27.22 66.35,27.22 66.35,25.74 65.26,25.74
M_BO2 on Top Layer: 62.68,27.22 63.72,27.22 63.72,25.74 62.68,25.74
$2N30836 on Top Layer: 58.22,12.01 72.28,12.01 72.28,8.63 58.22,8.63
$2N30844 on Top Layer: 70.21,7.83 74.85,7.83 74.85,2.73 70.21,2.73
$2N33541 on Top Layer: 14.33,5.11 27.3,5.11 27.3,1.81 14.33,1.81
$2N33543 on Top Layer: 23.17,12.87 33.75,12.87 33.75,7.19 23.17,7.19

Small or netless copper shapes (teardrops, artwork), in the pictures only: 26 on Inner1, 26 on Inner4

## Text on the board
Top Silkscreen Layer: Designed by / Viktor Hofer | Micro-Mouse Embedded-Systems-Design FH-Hagenberg
